# Altium project Kenworth_Overview_2.PrjPcb (part 1 of 4)
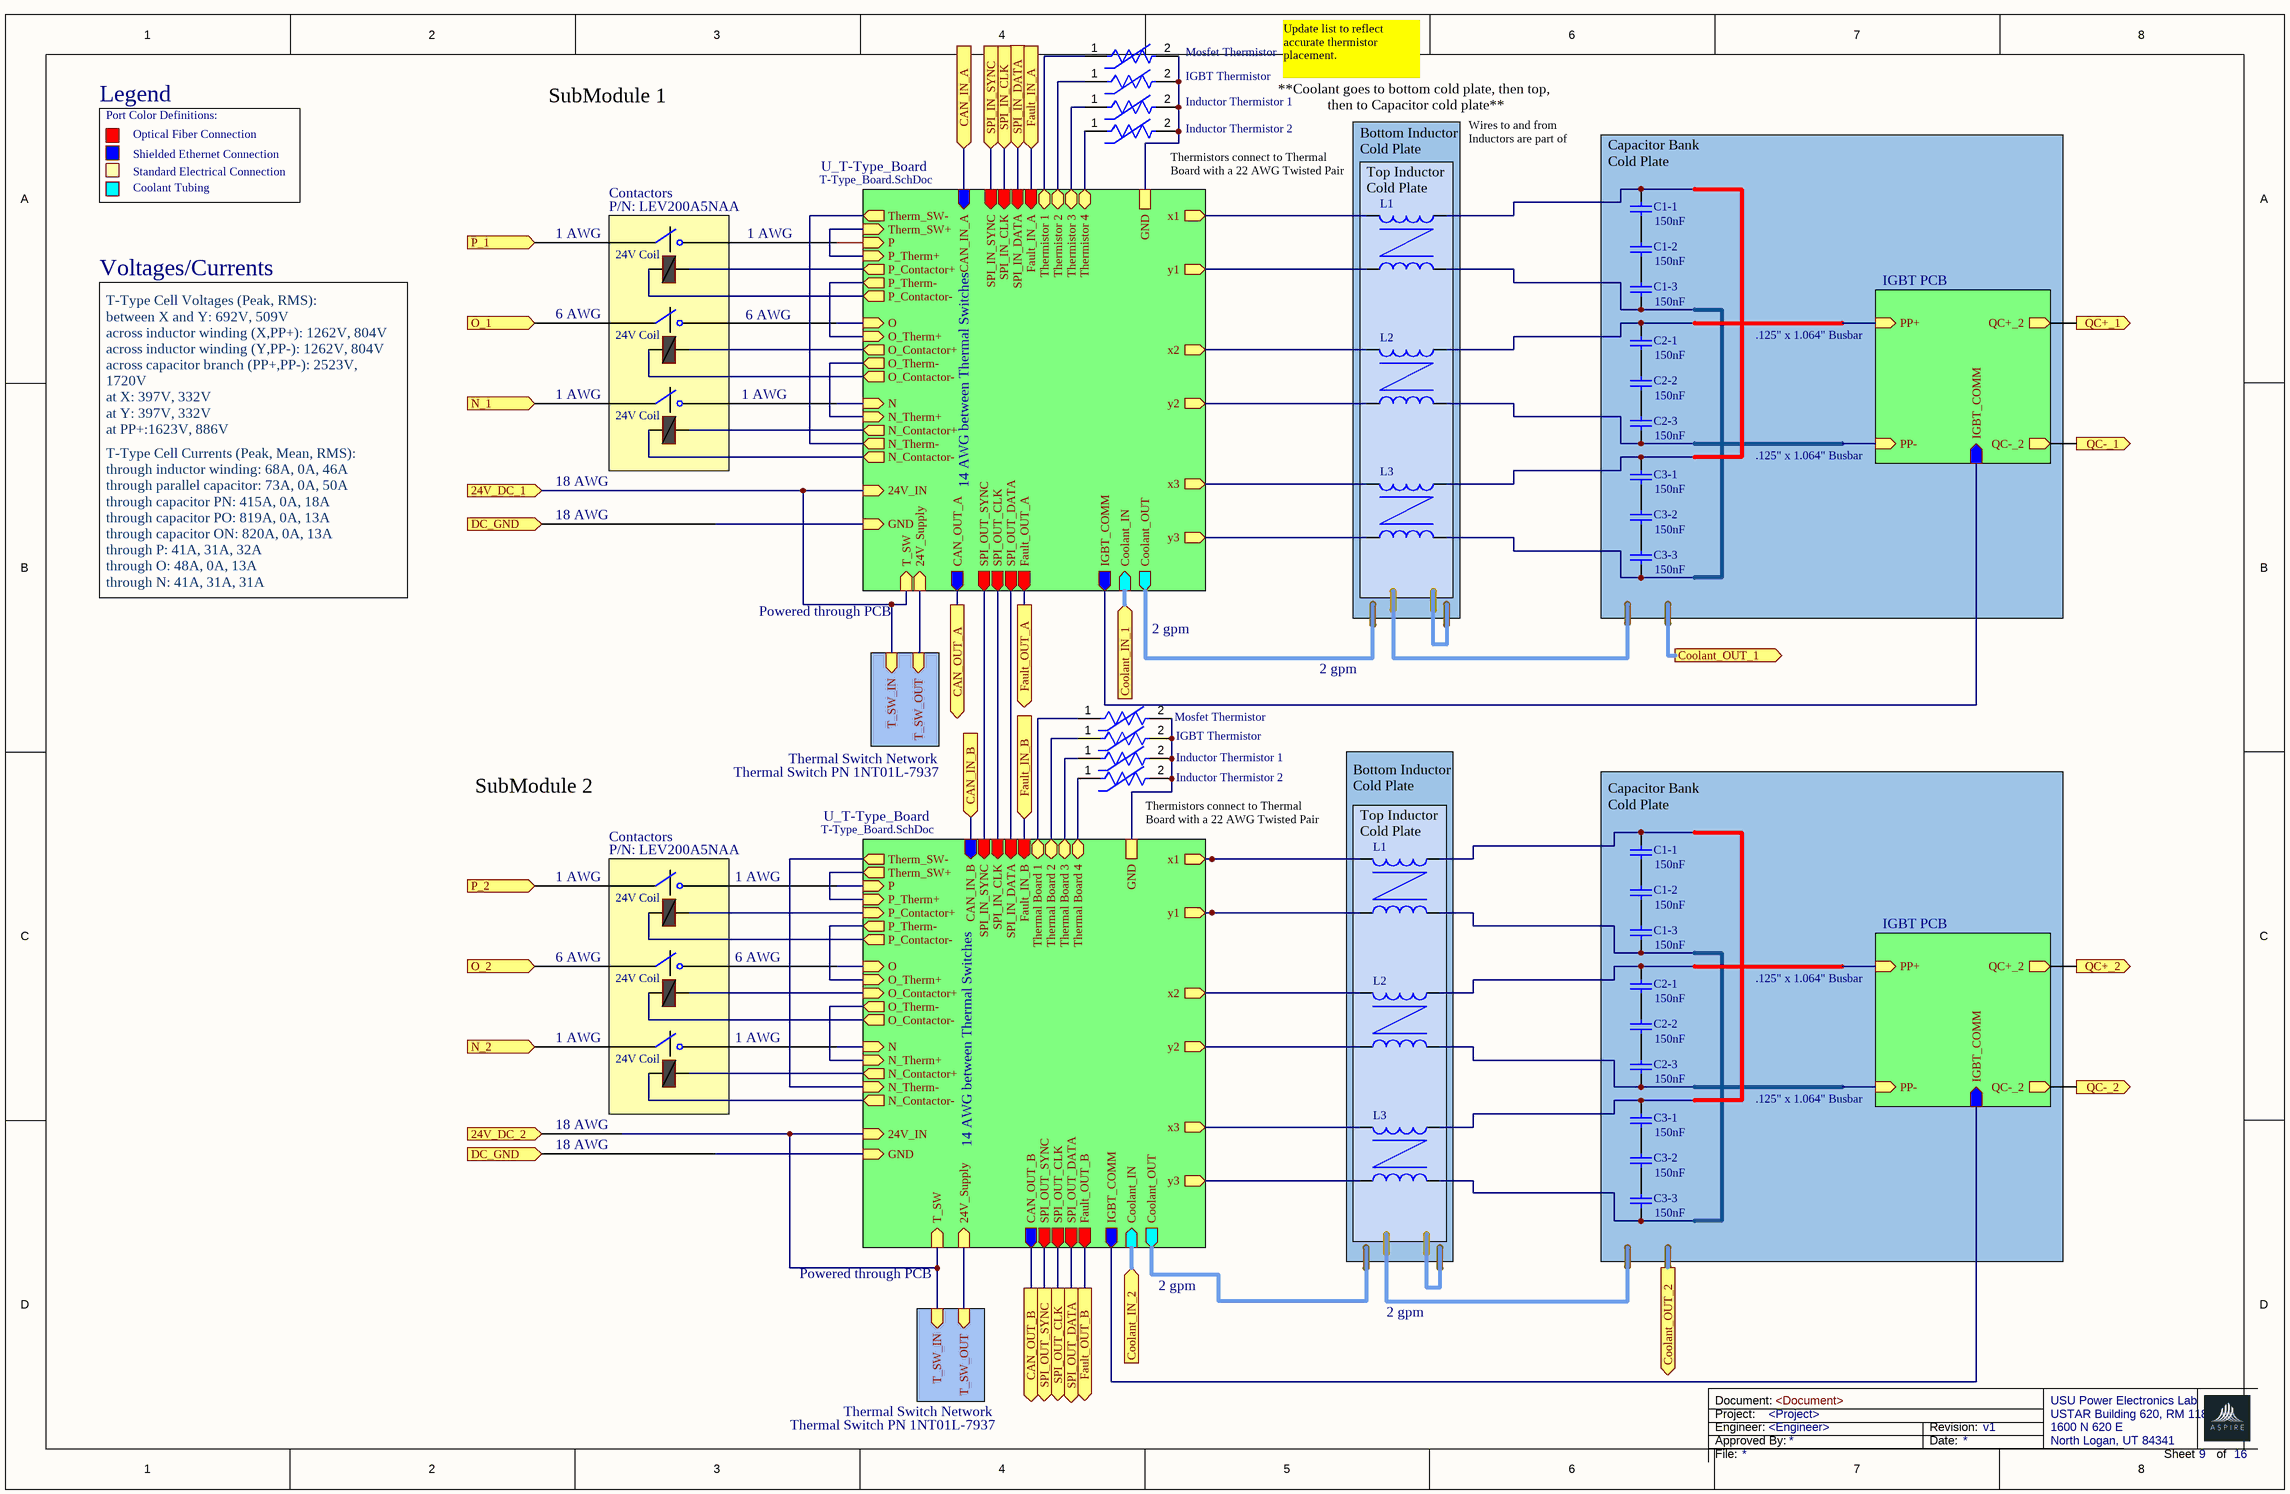
[diagram p0: Full_Module.SchDoc]
19 sheets, 617 parts. Net scope: hierarchical (ports join the sheet entries above them; power ports are global).
Sheets:
  Full_Module.SchDoc
    U_T-Type_Board = T-Type_Board.SchDoc
    U_T-Type_Board = T-Type_Board.SchDoc
    IGBT PCB = T-Type_Board.SchDoc
    IGBT PCB = T-Type_Board.SchDoc
  Primary_Cabinet.SchDoc
    Fuse Block = Fuse_Block.SchDoc
    Unfolder = Unfolder.SchDoc
    T-Type System = T-Type_System.SchDoc
  Coolant_System.SchDoc
  Current_and_Water_Sensing_System.SchDoc
  Top_Overview.SchDoc
    Special Equipment Cabinet = Special_Equipment_Cabinet_Overview.SchDoc
      Shunt Filter = Shunt_Filter.SchDoc
        U_RLC = RLC.SchDoc
        U_RLC = RLC.SchDoc
        U_RLC = RLC.SchDoc
      Auxiliary Circuit = Auxiliary_Circuit.SchDoc
      Relay Circuit = Relay_Circuit.SchDoc
    Secondary Pad = Vehicle_Charger_Hierarchal.SchDoc
      Filter = Filter.SchDoc
      U_Rectifier = Rectifier.SchDoc
    Primary Pad = Underground_Assembly.SchDoc
  Secondary_Pad_Auxiliary_Wiring_Overview.SchDoc

## Sheet Full_Module.SchDoc: <Document>
size Tabloid; Engineer: <Engineer>; Organization: UPEL; Address1: USU Power Electronics Lab; Address2: USTAR Building 620, RM 118; Address3: 1600 N 620 E; Address4: North Logan, UT 84341; DocumentNumber: 9; Revision: v1; SheetNumber: 9; SheetTotal: 16; ProjectName: <Project>

### Parts
(Parts that share a designator on the sheet are numbered #1, #2 ... from top to bottom, then left to right.)
C1-1#1  value 150nF  [RAD-0.3]  (hidden comment: Cap)
C1-1#2  value 150nF  [RAD-0.3]  (hidden comment: Cap)
C1-2#1  value 150nF  [RAD-0.3]  (hidden comment: Cap)
C1-2#2  value 150nF  [RAD-0.3]  (hidden comment: Cap)
C1-3#1  value 150nF  [RAD-0.3]  (hidden comment: Cap)
C1-3#2  value 150nF  [RAD-0.3]  (hidden comment: Cap)
C2-1#1  value 150nF  [RAD-0.3]  (hidden comment: Cap)
C2-1#2  value 150nF  [RAD-0.3]  (hidden comment: Cap)
C2-2#1  value 150nF  [RAD-0.3]  (hidden comment: Cap)
C2-2#2  value 150nF  [RAD-0.3]  (hidden comment: Cap)
C2-3#1  value 150nF  [RAD-0.3]  (hidden comment: Cap)
C2-3#2  value 150nF  [RAD-0.3]  (hidden comment: Cap)
C3-1#1  value 150nF  [RAD-0.3]  (hidden comment: Cap)
C3-1#2  value 150nF  [RAD-0.3]  (hidden comment: Cap)
C3-2#1  value 150nF  [RAD-0.3]  (hidden comment: Cap)
C3-2#2  value 150nF  [RAD-0.3]  (hidden comment: Cap)
C3-3#1  value 150nF  [RAD-0.3]  (hidden comment: Cap)
C3-3#2  value 150nF  [RAD-0.3]  (hidden comment: Cap)
IGBT_Thermistor#1  NTCALUG01A103J  [FP-NTCALUG01A103J-MFG]  (value not drawn)
IGBT_Thermistor#2  NTCALUG01A103J  [FP-NTCALUG01A103J-MFG]  (value not drawn)
Inductor_Thermistor_1#1  NTCALUG01A103J  [FP-NTCALUG01A103J-MFG]  (value not drawn)
Inductor_Thermistor_1#2  NTCALUG01A103J  [FP-NTCALUG01A103J-MFG]  (value not drawn)
Inductor_Thermistor_2#1  NTCALUG01A103J  [FP-NTCALUG01A103J-MFG]  (value not drawn)
Inductor_Thermistor_2#2  NTCALUG01A103J  [FP-NTCALUG01A103J-MFG]  (value not drawn)
K?#1  Contactor  (value not drawn)
K?#2  Contactor  (value not drawn)
K?#3  Contactor  (value not drawn)
K?#4  Contactor  (value not drawn)
K?#5  Contactor  (value not drawn)
K?#6  Contactor  (value not drawn)
L1#1  Inductor  [0402-A]  (value not drawn)
L1#2  Inductor  [0402-A]  (value not drawn)
L2#1  Inductor  [0402-A]  (value not drawn)
L2#2  Inductor  [0402-A]  (value not drawn)
L3#1  Inductor  [0402-A]  (value not drawn)
L3#2  Inductor  [0402-A]  (value not drawn)
L?#1  Inductor  [0402-A]  (value not drawn)
L?#2  Inductor  [0402-A]  (value not drawn)
L?#3  Inductor  [0402-A]  (value not drawn)
L?#4  Inductor  [0402-A]  (value not drawn)
L?#5  Inductor  [0402-A]  (value not drawn)
L?#6  Inductor  [0402-A]  (value not drawn)
Mosfet_Thermistor#1  NTCALUG01A103J  [FP-NTCALUG01A103J-MFG]  (value not drawn)
Mosfet_Thermistor#2  NTCALUG01A103J  [FP-NTCALUG01A103J-MFG]  (value not drawn)

### Sub-sheets
IGBT PCB = T-Type_Board.SchDoc: QC+_2 (out), QC-_2 (out), PP+ (in), PP- (in), IGBT_COMM (in)
IGBT PCB = T-Type_Board.SchDoc: QC+_2 (out), QC-_2 (out), PP+ (in), PP- (in), IGBT_COMM (in)
Thermal Switch Network = File Name (file not in this document): T_SW_OUT (in), T_SW_IN (in)
Thermal Switch Network = File Name (file not in this document): T_SW_OUT (in), T_SW_IN (in)
U_T-Type_Board = T-Type_Board.SchDoc: P (in), O (in), N (in), CAN_IN_A (in), GND (in), 24V_IN (in), Coolant_IN (in), Coolant_OUT (out), x1 (out), y1 (out), SPI_IN_SYNC (in), CAN_OUT_A (out), SPI_OUT_SYNC (out), Fault_OUT_A (out), SPI_OUT_CLK (out), SPI_OUT_DATA (out), SPI_IN_CLK (in), SPI_IN_DATA (in), Fault_IN_A (in), P_Contactor+ (out), P_Contactor- (out), O_Contactor+ (out), N_Contactor+ (out), O_Contactor- (out), N_Contactor- (out), x2 (out), y2 (out), x3 (out), y3 (out), T_SW (in), 24V_Supply (in), IGBT_COMM (out), P_Therm+ (in), P_Therm- (out), N_Therm- (out), N_Therm+ (in), O_Therm- (out), O_Therm+ (in), Therm_SW+ (in), Therm_SW- (out), Thermistor 4 (bidir), Thermistor 3 (bidir), Thermistor 2 (bidir), Thermistor 1 (bidir), GND
U_T-Type_Board = T-Type_Board.SchDoc: P (in), O (in), N (in), GND (in), 24V_IN (in), Coolant_IN (in), Coolant_OUT (out), SPI_IN_SYNC (in), SPI_OUT_SYNC (out), Fault_OUT_B (out), CAN_OUT_B (out), SPI_OUT_CLK (out), SPI_OUT_DATA (out), CAN_IN_B (in), SPI_IN_CLK (in), SPI_IN_DATA (in), Fault_IN_B (in), P_Contactor+ (in), P_Contactor- (out), O_Contactor+ (in), N_Contactor+ (out), O_Contactor- (out), N_Contactor- (out), x1 (out), y1 (out), x2 (out), y2 (out), x3 (out), y3 (out), T_SW (in), 24V_Supply (in), IGBT_COMM (out), N_Therm+ (in), N_Therm- (in), O_Therm+ (in), O_Therm- (out), P_Therm+ (in), P_Therm- (out), Therm_SW+ (out), Therm_SW- (out), Thermal Board 4 (bidir), Thermal Board 3 (bidir), Thermal Board 2 (bidir), Thermal Board 1 (bidir), GND

### Ports
24V_DC_1 (in), 24V_DC_2 (in), CAN_IN_A (in), CAN_IN_B (in), CAN_OUT_A (out), CAN_OUT_B (out), Coolant_IN_1 (in), Coolant_IN_2 (in), Coolant_OUT_1 (out), Coolant_OUT_2 (out), DC_GND (in), Fault_IN_A (in), Fault_IN_B (in), Fault_OUT_A (out), Fault_OUT_B (out), N_1 (in), N_2 (in), O_1 (in), O_2 (in), P_1 (in), P_2 (in), QC+_1 (out), QC+_2 (out), QC-_1 (out), QC-_2 (out), SPI_IN_CLK (in), SPI_IN_DATA (in), SPI_IN_SYNC (in), SPI_OUT_CLK (out), SPI_OUT_DATA (out), SPI_OUT_SYNC (out)

### Nets
24V_DC_1: port 24V_DC_1, sheet U_T-Type_Board/24V_IN, sheet U_T-Type_Board/T_SW, sheet Thermal Switch Network/T_SW_IN
24V_DC_2: port 24V_DC_2, sheet U_T-Type_Board/24V_IN, sheet U_T-Type_Board/T_SW, sheet Thermal Switch Network/T_SW_IN
CAN_IN_A: port CAN_IN_A, sheet U_T-Type_Board/CAN_IN_A
CAN_IN_B: port CAN_IN_B, sheet U_T-Type_Board/CAN_IN_B
CAN_OUT_A: port CAN_OUT_A, sheet U_T-Type_Board/CAN_OUT_A
CAN_OUT_B: port CAN_OUT_B, sheet U_T-Type_Board/CAN_OUT_B
Coolant_IN_U_T-Type_Board: port Coolant_IN_1, sheet U_T-Type_Board/Coolant_IN
Coolant_IN_U_T-Type_Board: port Coolant_IN_2, sheet U_T-Type_Board/Coolant_IN  [a separate net that carries the same name]
DC_GND: IGBT_Thermistor#1.2 IGBT_Thermistor#2.2 Inductor_Thermistor_1#1.2 Inductor_Thermistor_1#2.2 Inductor_Thermistor_2#1.2 Inductor_Thermistor_2#2.2 Mosfet_Thermistor#1.2 Mosfet_Thermistor#2.2 ; port DC_GND, sheet U_T-Type_Board/GND, sheet U_T-Type_Board/GND, sheet U_T-Type_Board/GND, sheet U_T-Type_Board/GND
Fault_IN_A: port Fault_IN_A, sheet U_T-Type_Board/Fault_IN_A
Fault_IN_B: port Fault_IN_B, sheet U_T-Type_Board/Fault_IN_B
Fault_OUT_A: port Fault_OUT_A, sheet U_T-Type_Board/Fault_OUT_A
Fault_OUT_B: port Fault_OUT_B, sheet U_T-Type_Board/Fault_OUT_B
N: K?#3.4 ; sheet U_T-Type_Board/N
N: K?#6.4 ; sheet U_T-Type_Board/N  [a separate net that carries the same name]
N_1: K?#3.3 ; port N_1
N_2: K?#6.3 ; port N_2
N_Contactor+: K?#3.5 ; sheet U_T-Type_Board/N_Contactor+
N_Contactor+: K?#6.5 ; sheet U_T-Type_Board/N_Contactor+  [a separate net that carries the same name]
N_Contactor-: K?#3.6 ; sheet U_T-Type_Board/N_Contactor-
N_Contactor-: K?#6.6 ; sheet U_T-Type_Board/N_Contactor-  [a separate net that carries the same name]
O: K?#2.4 ; sheet U_T-Type_Board/O
O: K?#5.4 ; sheet U_T-Type_Board/O  [a separate net that carries the same name]
O_1: K?#2.3 ; port O_1
O_2: K?#5.3 ; port O_2
O_Contactor+: K?#2.5 ; sheet U_T-Type_Board/O_Contactor+
O_Contactor+: K?#5.5 ; sheet U_T-Type_Board/O_Contactor+  [a separate net that carries the same name]
O_Contactor-: K?#2.6 ; sheet U_T-Type_Board/O_Contactor-
O_Contactor-: K?#5.6 ; sheet U_T-Type_Board/O_Contactor-  [a separate net that carries the same name]
P: K?#1.4 ; sheet U_T-Type_Board/P
P: K?#4.4 ; sheet U_T-Type_Board/P  [a separate net that carries the same name]
P_1: K?#1.3 ; port P_1
P_2: K?#4.3 ; port P_2
P_Contactor+: K?#1.5 ; sheet U_T-Type_Board/P_Contactor+
P_Contactor+: K?#4.5 ; sheet U_T-Type_Board/P_Contactor+  [a separate net that carries the same name]
P_Contactor-: K?#1.6 ; sheet U_T-Type_Board/P_Contactor-
P_Contactor-: K?#4.6 ; sheet U_T-Type_Board/P_Contactor-  [a separate net that carries the same name]
PP+: C2-1#2.2 L2#2.1 ; sheet IGBT PCB/PP+
PP+: C2-1#1.2 L2#1.1 ; sheet IGBT PCB/PP+  [a separate net that carries the same name]
PP-: C2-3#2.1 L?#5.2 ; sheet IGBT PCB/PP-
PP-: C2-3#1.1 L?#2.2 ; sheet IGBT PCB/PP-  [a separate net that carries the same name]
QC+_1: port QC+_1, sheet IGBT PCB/QC+_2
QC+_2: port QC+_2, sheet IGBT PCB/QC+_2
QC-_1: port QC-_1, sheet IGBT PCB/QC-_2
QC-_2: port QC-_2, sheet IGBT PCB/QC-_2
SPI_IN_CLK: port SPI_IN_CLK, sheet U_T-Type_Board/SPI_IN_CLK
SPI_IN_CLK_U_T-Type_Board: sheet U_T-Type_Board/SPI_OUT_CLK, sheet U_T-Type_Board/SPI_IN_CLK
SPI_IN_DATA: port SPI_IN_DATA, sheet U_T-Type_Board/SPI_IN_DATA
SPI_IN_DATA_U_T-Type_Board: sheet U_T-Type_Board/SPI_OUT_DATA, sheet U_T-Type_Board/SPI_IN_DATA
SPI_IN_SYNC: port SPI_IN_SYNC, sheet U_T-Type_Board/SPI_IN_SYNC
SPI_IN_SYNC_U_T-Type_Board: sheet U_T-Type_Board/SPI_OUT_SYNC, sheet U_T-Type_Board/SPI_IN_SYNC
SPI_OUT_CLK: port SPI_OUT_CLK, sheet U_T-Type_Board/SPI_OUT_CLK
SPI_OUT_DATA: port SPI_OUT_DATA, sheet U_T-Type_Board/SPI_OUT_DATA
SPI_OUT_SYNC: port SPI_OUT_SYNC, sheet U_T-Type_Board/SPI_OUT_SYNC
NetC1-1#1_1: C1-1#1.1 C1-2#1.2
NetC1-1#1_2: C1-1#1.2 C3-1#1.2 L1#1.1 L3#1.1
NetC1-1#2_1: C1-1#2.1 C1-2#2.2
NetC1-1#2_2: C1-1#2.2 C3-1#2.2 L1#2.1 L3#2.1
NetC1-2#1_1: C1-2#1.1 C1-3#1.2
NetC1-2#2_1: C1-2#2.1 C1-3#2.2
NetC1-3#1_1: C1-3#1.1 C3-3#1.1 L?#1.2 L?#3.2
NetC1-3#2_1: C1-3#2.1 C3-3#2.1 L?#4.2 L?#6.2
NetC2-1#1_1: C2-1#1.1 C2-2#1.2
NetC2-1#2_1: C2-1#2.1 C2-2#2.2
NetC2-2#1_1: C2-2#1.1 C2-3#1.2
NetC2-2#2_1: C2-2#2.1 C2-3#2.2
NetC3-1#1_1: C3-1#1.1 C3-2#1.2
NetC3-1#2_1: C3-1#2.1 C3-2#2.2
NetC3-2#1_1: C3-2#1.1 C3-3#1.2
NetC3-2#2_1: C3-2#2.1 C3-3#2.2
NetIGBT_Thermistor#1_1: IGBT_Thermistor#1.1 ; sheet U_T-Type_Board/Thermistor 2
NetIGBT_Thermistor#2_1: IGBT_Thermistor#2.1 ; sheet U_T-Type_Board/Thermal Board 2
NetInductor_Thermistor_1#1_1: Inductor_Thermistor_1#1.1 ; sheet U_T-Type_Board/Thermistor 3
NetInductor_Thermistor_1#2_1: Inductor_Thermistor_1#2.1 ; sheet U_T-Type_Board/Thermal Board 3
NetInductor_Thermistor_2#1_1: Inductor_Thermistor_2#1.1 ; sheet U_T-Type_Board/Thermistor 4
NetInductor_Thermistor_2#2_1: Inductor_Thermistor_2#2.1 ; sheet U_T-Type_Board/Thermal Board 4
NetL1#1_2: L1#1.2 ; sheet U_T-Type_Board/x1
NetL1#2_2: L1#2.2 ; sheet U_T-Type_Board/x1
NetL2#1_2: L2#1.2 ; sheet U_T-Type_Board/x2
NetL2#2_2: L2#2.2 ; sheet U_T-Type_Board/x2
NetL3#1_2: L3#1.2 ; sheet U_T-Type_Board/x3
NetL3#2_2: L3#2.2 ; sheet U_T-Type_Board/x3
NetL?#1_1: L?#1.1 ; sheet U_T-Type_Board/y1
NetL?#2_1: L?#2.1 ; sheet U_T-Type_Board/y2
NetL?#3_1: L?#3.1 ; sheet U_T-Type_Board/y3
NetL?#4_1: L?#4.1 ; sheet U_T-Type_Board/y1
NetL?#5_1: L?#5.1 ; sheet U_T-Type_Board/y2
NetL?#6_1: L?#6.1 ; sheet U_T-Type_Board/y3
NetMosfet_Thermistor#1_1: Mosfet_Thermistor#1.1 ; sheet U_T-Type_Board/Thermistor 1
NetMosfet_Thermistor#2_1: Mosfet_Thermistor#2.1 ; sheet U_T-Type_Board/Thermal Board 1
(unnamed): sheet U_T-Type_Board/24V_Supply, sheet Thermal Switch Network/T_SW_OUT
(unnamed): sheet U_T-Type_Board/IGBT_COMM, sheet IGBT PCB/IGBT_COMM
(unnamed): sheet U_T-Type_Board/P_Therm+, sheet U_T-Type_Board/Therm_SW+
(unnamed): sheet U_T-Type_Board/P_Therm-, sheet U_T-Type_Board/O_Therm+
(unnamed): sheet U_T-Type_Board/N_Therm-, sheet U_T-Type_Board/Therm_SW-
(unnamed): sheet U_T-Type_Board/N_Therm+, sheet U_T-Type_Board/O_Therm-
(unnamed): sheet U_T-Type_Board/24V_Supply, sheet Thermal Switch Network/T_SW_OUT
(unnamed): sheet U_T-Type_Board/IGBT_COMM, sheet IGBT PCB/IGBT_COMM
(unnamed): sheet U_T-Type_Board/N_Therm+, sheet U_T-Type_Board/O_Therm-
(unnamed): sheet U_T-Type_Board/N_Therm-, sheet U_T-Type_Board/Therm_SW-
(unnamed): sheet U_T-Type_Board/O_Therm+, sheet U_T-Type_Board/P_Therm-
(unnamed): sheet U_T-Type_Board/P_Therm+, sheet U_T-Type_Board/Therm_SW+

### Notes on the sheet
- Legend
- SubModule 1
- Update list to reflect accurate thermistor placement.
- Port Color Definitions:
- Optical Fiber Connection
- Shielded Ethernet Connection
- Standard Electrical Connection
- **Coolant goes to bottom cold plate, then top,
  then to Capacitor cold plate**
- Bottom Inductor Cold Plate
- Wires to and from Inductors are part of custom made inductors
- (near C1-1#1) Capacitor Bank Cold Plate
- Coolant Tubing
- 1 AWG
- (near K?#1) Contactors
- (near K?#1) P/N: LEV200A5NAA
- (near Inductor_Thermistor_2#1) Thermistors connect to Thermal Board with a 22 AWG Twisted Pair with GND
- (near L1#1) Top Inductor Cold Plate
- Voltages/Currents
- (near K?#1) 24V Coil
- 6 AWG
- (near K?#2) 24V Coil
- .125" x 1.064" Busbar
- T-Type Cell Voltages (Peak, RMS):
  between X and Y: 692V, 509V
  across inductor winding (X,PP+): 1262V, 804V
  across inductor winding (Y,PP-): 1262V, 804V
  across capacitor branch (PP+,PP-): 2523V, 1720V
  at X: 397V, 332V
  at Y: 397V, 332V
  at PP+:1623V, 886V
  at PP-: 1623V, 886V
- (near K?#3) 24V Coil
- 18 AWG
- 14 AWG between Thermal Switches
- T-Type Cell Currents (Peak, Mean, RMS):
  through inductor winding: 68A, 0A, 46A
  through parallel capacitor: 73A, 0A, 50A
  through capacitor PN: 415A, 0A, 18A
  through capacitor PO: 819A, 0A, 13A
  through capacitor ON: 820A, 0A, 13A
  through P: 41A, 31A, 32A
  through O: 48A, 0A, 13A
  through N: 41A, 31A, 31A
- Powered through PCB
- 2 gpm
- Thermal Switch PN 1NT01L-7937
- Thermal Switch Network
- SubModule 2
- (near K?#4) Contactors
- (near Inductor_Thermistor_2#2) Thermistors connect to Thermal Board with a 22 AWG Twisted Pair with GND
- (near L1#2) Top Inductor Cold Plate
- (near C1-1#2) Capacitor Bank Cold Plate
- (near K?#4) P/N: LEV200A5NAA
- (near K?#4) 24V Coil
- (near K?#4) 1 AWG
- (near K?#5) 24V Coil
- (near K?#5) 6 AWG
- (near K?#6) 1 AWG
- (near K?#6) 24V Coil
- Project:
- Engineer:
- Document:
- Approved By:
- Date:
- Revision:
- File:
- Sheet
- of

### Library data of the parts
C1-1#1 C1-1#2 C1-2#1 C1-2#2 C1-3#1 C1-3#2 C2-1#1 C2-1#2 C2-2#1 C2-2#2 C2-3#1 C2-3#2 C3-1#1 C3-1#2 C3-2#1 C3-2#2 C3-3#1 C3-3#2 = Cap: Capacitor; Published: 8-Jun-2000; LatestRevisionDate: 17-Jul-2002; LatestRevisionNote: Re-released for DXP Platform.; PackageReference: RAD-0.3; Publisher: Altium Limited; PackageDescription: Radial Cap, Thru-Hole; 2 Leads; 0.3 in Pin Spacing
IGBT_Thermistor#1 IGBT_Thermistor#2 Inductor_Thermistor_1#1 Inductor_Thermistor_1#2 Inductor_Thermistor_2#1 Inductor_Thermistor_2#2 Mosfet_Thermistor#1 Mosfet_Thermistor#2 = CMP-009-00000-2: NTC Thermistor, 10000ohm, Chassis Mount
L1#1 L1#2 L2#1 L2#2 L3#1 L3#2 L?#1-L?#6 = Inductor: Code_IEC: 1005; Value: 10mH; Published: 8-Jun-2000; LatestRevisionDate: 29-May-2009; LatestRevisionNote: IPC-7351 Footprint Added.; PackageReference: 0402-A; Publisher: Altium Limited; PackageDescription: Chip Inductor; Code_JEITA: 0402

## Sheet T-Type_Board.SchDoc: <Document>
size Letter; Engineer: <Engineer>; Organization: UPEL; Address1: USU Power Electronics Lab; Address2: USTAR Building 620, RM 118; Address3: 1600 N 620 E; Address4: North Logan, UT 84341; DocumentNumber: 10; Revision: v1; SheetNumber: 10; SheetTotal: 16; ProjectName: <Project>
Used 4 times, as channels U_T-Type_Board, U_T-Type_Board, IGBT PCB, IGBT PCB. Parts and nets are listed once, with the designators drawn on the sheet.
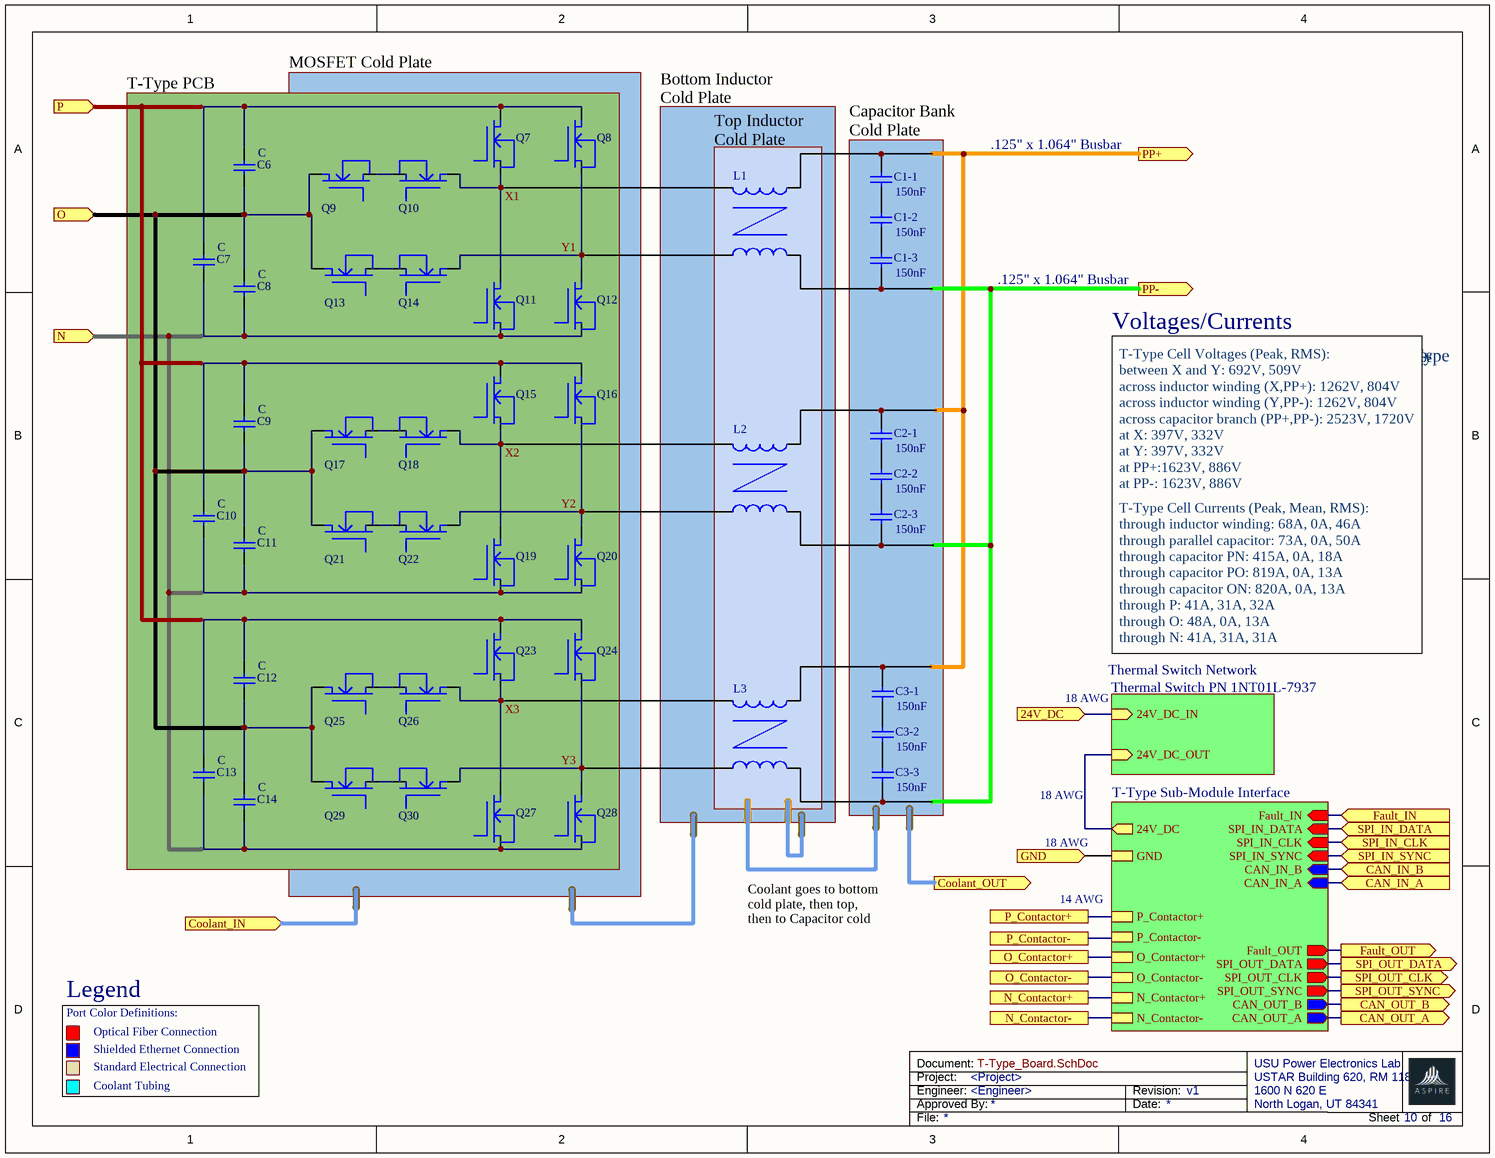
[diagram p1: T-Type_Board.SchDoc]

### Parts
(Parts that share a designator on the sheet are numbered #1, #2 ... from top to bottom, then left to right.)
C1-1  value 150nF  [RAD-0.3]  (hidden comment: Cap)
C1-2  value 150nF  [RAD-0.3]  (hidden comment: Cap)
C1-3  value 150nF  [RAD-0.3]  (hidden comment: Cap)
C2-1  value 150nF  [RAD-0.3]  (hidden comment: Cap)
C2-2  value 150nF  [RAD-0.3]  (hidden comment: Cap)
C2-3  value 150nF  [RAD-0.3]  (hidden comment: Cap)
C3-1  value 150nF  [RAD-0.3]  (hidden comment: Cap)
C3-2  value 150nF  [RAD-0.3]  (hidden comment: Cap)
C3-3  value 150nF  [RAD-0.3]  (hidden comment: Cap)
C6  C  [RAD-0.3]
C7  C  [RAD-0.3]
C8  C  [RAD-0.3]
C9  C  [RAD-0.3]
C10  C  [RAD-0.3]
C11  C  [RAD-0.3]
C12  C  [RAD-0.3]
C13  C  [RAD-0.3]
C14  C  [RAD-0.3]
L1  Inductor  [0402-A]  (value not drawn)
L2  Inductor  [0402-A]  (value not drawn)
L3  Inductor  [0402-A]  (value not drawn)
L?#1  Inductor  [0402-A]  (value not drawn)
L?#2  Inductor  [0402-A]  (value not drawn)
L?#3  Inductor  [0402-A]  (value not drawn)
Q7  T-Cell_component  (value not drawn)
Q8  T-Cell_component  (value not drawn)
Q9  T-Cell_component  (value not drawn)
Q10  T-Cell_component  (value not drawn)
Q11  T-Cell_component  (value not drawn)
Q12  T-Cell_component  (value not drawn)
Q13  T-Cell_component  (value not drawn)
Q14  T-Cell_component  (value not drawn)
Q15  T-Cell_component  (value not drawn)
Q16  T-Cell_component  (value not drawn)
Q17  T-Cell_component  (value not drawn)
Q18  T-Cell_component  (value not drawn)
Q19  T-Cell_component  (value not drawn)
Q20  T-Cell_component  (value not drawn)
Q21  T-Cell_component  (value not drawn)
Q22  T-Cell_component  (value not drawn)
Q23  T-Cell_component  (value not drawn)
Q24  T-Cell_component  (value not drawn)
Q25  T-Cell_component  (value not drawn)
Q26  T-Cell_component  (value not drawn)
Q27  T-Cell_component  (value not drawn)
Q28  T-Cell_component  (value not drawn)
Q29  T-Cell_component  (value not drawn)
Q30  T-Cell_component  (value not drawn)

### Blocks framed on the sheet
MOSFET Cold Plate: Q7-Q30

### Sub-sheets
T-Type Sub-Module Interface = File Name (file not in this document): 24V_DC (out), GND, CAN_IN_A (in), SPI_IN_SYNC (in), CAN_IN_B (in), SPI_IN_CLK (in), SPI_IN_DATA (in), Fault_IN (in), CAN_OUT_A (out), SPI_OUT_SYNC (out), Fault_OUT (out), CAN_OUT_B (out), SPI_OUT_CLK (out), SPI_OUT_DATA (out), P_Contactor+, P_Contactor-, O_Contactor+, O_Contactor-, N_Contactor+, N_Contactor-
Thermal Switch Network = File Name (file not in this document): 24V_DC_IN (in), 24V_DC_OUT (in)

### Ports
24V_DC (in), CAN_IN_A (in), CAN_IN_B (in), CAN_OUT_A (out), CAN_OUT_B (out), Coolant_IN (in), Coolant_OUT (out), Fault_IN (in), Fault_OUT (out), GND (in), N (in), N_Contactor+, N_Contactor-, O (in), O_Contactor+, O_Contactor-, P (in), P_Contactor+, P_Contactor-, PP+ (out), PP- (out), SPI_IN_CLK (in), SPI_IN_DATA (in), SPI_IN_SYNC (in), SPI_OUT_CLK (out), SPI_OUT_DATA (out), SPI_OUT_SYNC (out)

### Nets
24V_DC: port 24V_DC, sheet Thermal Switch Network/24V_DC_IN
CAN_IN_A: port CAN_IN_A, sheet T-Type Sub-Module Interface/CAN_IN_A
CAN_IN_B: port CAN_IN_B, sheet T-Type Sub-Module Interface/CAN_IN_B
CAN_OUT_A: port CAN_OUT_A, sheet T-Type Sub-Module Interface/CAN_OUT_A
CAN_OUT_B: port CAN_OUT_B, sheet T-Type Sub-Module Interface/CAN_OUT_B
Fault_IN: port Fault_IN, sheet T-Type Sub-Module Interface/Fault_IN
Fault_OUT: port Fault_OUT, sheet T-Type Sub-Module Interface/Fault_OUT
GND: port GND, sheet T-Type Sub-Module Interface/GND
N_Contactor+: port N_Contactor+, sheet T-Type Sub-Module Interface/N_Contactor+
N_Contactor-: port N_Contactor-, sheet T-Type Sub-Module Interface/N_Contactor-
O: C9.1 C11.2 Q17.4 Q21.4 ; port O
O_Contactor+: port O_Contactor+, sheet T-Type Sub-Module Interface/O_Contactor+
O_Contactor-: port O_Contactor-, sheet T-Type Sub-Module Interface/O_Contactor-
P_Contactor+: port P_Contactor+, sheet T-Type Sub-Module Interface/P_Contactor+
PP+: C1-1.2 C2-1.2 C3-1.2 L1.1 L2.1 L3.1 ; port PP+
PP-: C1-3.1 C2-3.1 C3-3.1 L?#1.2 L?#2.2 L?#3.2 ; port PP-
SPI_IN_CLK: port SPI_IN_CLK, sheet T-Type Sub-Module Interface/SPI_IN_CLK
SPI_IN_DATA: port SPI_IN_DATA, sheet T-Type Sub-Module Interface/SPI_IN_DATA
SPI_IN_SYNC: port SPI_IN_SYNC, sheet T-Type Sub-Module Interface/SPI_IN_SYNC
SPI_OUT_CLK: port SPI_OUT_CLK, sheet T-Type Sub-Module Interface/SPI_OUT_CLK
SPI_OUT_DATA: port SPI_OUT_DATA, sheet T-Type Sub-Module Interface/SPI_OUT_DATA
SPI_OUT_SYNC: port SPI_OUT_SYNC, sheet T-Type Sub-Module Interface/SPI_OUT_SYNC
X1: L1.2 Q7.5 Q10.4 Q11.4
X2: L2.2 Q15.5 Q18.4 Q19.4
X3: L3.2 Q23.5 Q26.4 Q27.4
Y1: L?#1.1 Q8.5 Q12.4 Q14.4
Y2: L?#2.1 Q16.5 Q20.4 Q22.4
Y3: L?#3.1 Q24.5 Q28.4 Q30.4
NetC1-1_1: C1-1.1 C1-2.2
NetC1-2_1: C1-2.1 C1-3.2
NetC2-1_1: C2-1.1 C2-2.2
NetC2-2_1: C2-2.1 C2-3.2
NetC3-1_1: C3-1.1 C3-2.2
NetC3-2_1: C3-2.1 C3-3.2
NetC6_1: C6.1 C8.2 Q9.4 Q13.4
NetC6_2: C6.2 C7.2 Q7.4 Q8.4
NetC7_1: C7.1 C8.1 Q11.5 Q12.5
NetC9_2: C9.2 C10.2 Q15.4 Q16.4
NetC10_1: C10.1 C11.1 Q19.5 Q20.5
NetC12_1: C12.1 C14.2 Q25.4 Q29.4
NetC12_2: C12.2 C13.2 Q23.4 Q24.4
NetC13_1: C13.1 C14.1 Q27.5 Q28.5
NetQ9_5: Q9.5 Q10.5
NetQ13_5: Q13.5 Q14.5
NetQ17_5: Q17.5 Q18.5
NetQ21_5: Q21.5 Q22.5
NetQ25_5: Q25.5 Q26.5
NetQ29_5: Q29.5 Q30.5
(unnamed): sheet T-Type Sub-Module Interface/24V_DC, sheet Thermal Switch Network/24V_DC_OUT

### Channels
U_T-Type_Board: designators C1-1=C1-1_U_T-Type_Board#1 C1-2=C1-2_U_T-Type_Board#1 C1-3=C1-3_U_T-Type_Board#1 C2-1=C2-1_U_T-Type_Board#1 C2-2=C2-2_U_T-Type_Board#1 C2-3=C2-3_U_T-Type_Board#1 C3-1=C3-1_U_T-Type_Board#1 C3-2=C3-2_U_T-Type_Board#1 C3-3=C3-3_U_T-Type_Board#1 C6=C6_U_T-Type_Board#1 C7=C7_U_T-Type_Board#1 C8=C8_U_T-Type_Board#1 C9=C9_U_T-Type_Board#1 C10=C10_U_T-Type_Board#1 C11=C11_U_T-Type_Board#1 C12=C12_U_T-Type_Board#1 C13=C13_U_T-Type_Board#1 C14=C14_U_T-Type_Board#1 L1=L1_U_T-Type_Board#1 L2=L2_U_T-Type_Board#1 L3=L3_U_T-Type_Board#1 L?=L?_U_T-Type_Board#1 L?=L?_U_T-Type_Board#2 L?=L?_U_T-Type_Board#3 Q7=Q7_U_T-Type_Board#1 Q8=Q8_U_T-Type_Board#1 Q9=Q9_U_T-Type_Board#1 Q10=Q10_U_T-Type_Board#1 Q11=Q11_U_T-Type_Board#1 Q12=Q12_U_T-Type_Board#1 Q13=Q13_U_T-Type_Board#1 Q14=Q14_U_T-Type_Board#1 Q15=Q15_U_T-Type_Board#1 Q16=Q16_U_T-Type_Board#1 Q17=Q17_U_T-Type_Board#1 Q18=Q18_U_T-Type_Board#1 Q19=Q19_U_T-Type_Board#1 Q20=Q20_U_T-Type_Board#1 Q21=Q21_U_T-Type_Board#1 Q22=Q22_U_T-Type_Board#1 Q23=Q23_U_T-Type_Board#1 Q24=Q24_U_T-Type_Board#1 Q25=Q25_U_T-Type_Board#1 Q26=Q26_U_T-Type_Board#1 Q27=Q27_U_T-Type_Board#1 Q28=Q28_U_T-Type_Board#1 Q29=Q29_U_T-Type_Board#1 Q30=Q30_U_T-Type_Board#1; ports 24V_DC=24V_DC_U_T-Type_Board CAN_IN_A=CAN_IN_A CAN_IN_B=CAN_IN_B_U_T-Type_Board CAN_OUT_A=CAN_OUT_A CAN_OUT_B=CAN_OUT_B_U_T-Type_Board Coolant_IN=Coolant_IN_U_T-Type_Board Coolant_OUT=Coolant_OUT_U_T-Type_Board Fault_IN=Fault_IN_U_T-Type_Board Fault_OUT=Fault_OUT_U_T-Type_Board GND=DC_GND N=N N_Contactor+=N_Contactor+ N_Contactor-=N_Contactor- O=O O_Contactor+=O_Contactor+ O_Contactor-=O_Contactor- P=P P_Contactor+=P_Contactor+ P_Contactor-=P_Contactor- PP+=PP+_U_T-Type_Board PP-=PP-_U_T-Type_Board SPI_IN_CLK=SPI_IN_CLK SPI_IN_DATA=SPI_IN_DATA SPI_IN_SYNC=SPI_IN_SYNC SPI_OUT_CLK=SPI_IN_CLK_U_T-Type_Board SPI_OUT_DATA=SPI_IN_DATA_U_T-Type_Board SPI_OUT_SYNC=SPI_IN_SYNC_U_T-Type_Board
U_T-Type_Board: designators C1-1=C1-1_U_T-Type_Board#2 C1-2=C1-2_U_T-Type_Board#2 C1-3=C1-3_U_T-Type_Board#2 C2-1=C2-1_U_T-Type_Board#2 C2-2=C2-2_U_T-Type_Board#2 C2-3=C2-3_U_T-Type_Board#2 C3-1=C3-1_U_T-Type_Board#2 C3-2=C3-2_U_T-Type_Board#2 C3-3=C3-3_U_T-Type_Board#2 C6=C6_U_T-Type_Board#2 C7=C7_U_T-Type_Board#2 C8=C8_U_T-Type_Board#2 C9=C9_U_T-Type_Board#2 C10=C10_U_T-Type_Board#2 C11=C11_U_T-Type_Board#2 C12=C12_U_T-Type_Board#2 C13=C13_U_T-Type_Board#2 C14=C14_U_T-Type_Board#2 L1=L1_U_T-Type_Board#2 L2=L2_U_T-Type_Board#2 L3=L3_U_T-Type_Board#2 L?=L?_U_T-Type_Board#4 L?=L?_U_T-Type_Board#5 L?=L?_U_T-Type_Board#6 Q7=Q7_U_T-Type_Board#2 Q8=Q8_U_T-Type_Board#2 Q9=Q9_U_T-Type_Board#2 Q10=Q10_U_T-Type_Board#2 Q11=Q11_U_T-Type_Board#2 Q12=Q12_U_T-Type_Board#2 Q13=Q13_U_T-Type_Board#2 Q14=Q14_U_T-Type_Board#2 Q15=Q15_U_T-Type_Board#2 Q16=Q16_U_T-Type_Board#2 Q17=Q17_U_T-Type_Board#2 Q18=Q18_U_T-Type_Board#2 Q19=Q19_U_T-Type_Board#2 Q20=Q20_U_T-Type_Board#2 Q21=Q21_U_T-Type_Board#2 Q22=Q22_U_T-Type_Board#2 Q23=Q23_U_T-Type_Board#2 Q24=Q24_U_T-Type_Board#2 Q25=Q25_U_T-Type_Board#2 Q26=Q26_U_T-Type_Board#2 Q27=Q27_U_T-Type_Board#2 Q28=Q28_U_T-Type_Board#2 Q29=Q29_U_T-Type_Board#2 Q30=Q30_U_T-Type_Board#2; ports 24V_DC=24V_DC_U_T-Type_Board CAN_IN_A=CAN_IN_A_U_T-Type_Board CAN_IN_B=CAN_IN_B CAN_OUT_A=CAN_OUT_A_U_T-Type_Board CAN_OUT_B=CAN_OUT_B Coolant_IN=Coolant_IN_U_T-Type_Board Coolant_OUT=Coolant_OUT_U_T-Type_Board Fault_IN=Fault_IN_U_T-Type_Board Fault_OUT=Fault_OUT_U_T-Type_Board GND=DC_GND N=N N_Contactor+=N_Contactor+ N_Contactor-=N_Contactor- O=O O_Contactor+=O_Contactor+ O_Contactor-=O_Contactor- P=P P_Contactor+=P_Contactor+ P_Contactor-=P_Contactor- PP+=PP+_U_T-Type_Board PP-=PP-_U_T-Type_Board SPI_IN_CLK=SPI_IN_CLK_U_T-Type_Board SPI_IN_DATA=SPI_IN_DATA_U_T-Type_Board SPI_IN_SYNC=SPI_IN_SYNC_U_T-Type_Board SPI_OUT_CLK=SPI_OUT_CLK SPI_OUT_DATA=SPI_OUT_DATA SPI_OUT_SYNC=SPI_OUT_SYNC
IGBT PCB: designators C1-1=C1-1_IGBT_PCB#1 C1-2=C1-2_IGBT_PCB#1 C1-3=C1-3_IGBT_PCB#1 C2-1=C2-1_IGBT_PCB#1 C2-2=C2-2_IGBT_PCB#1 C2-3=C2-3_IGBT_PCB#1 C3-1=C3-1_IGBT_PCB#1 C3-2=C3-2_IGBT_PCB#1 C3-3=C3-3_IGBT_PCB#1 C6=C6_IGBT_PCB#1 C7=C7_IGBT_PCB#1 C8=C8_IGBT_PCB#1 C9=C9_IGBT_PCB#1 C10=C10_IGBT_PCB#1 C11=C11_IGBT_PCB#1 C12=C12_IGBT_PCB#1 C13=C13_IGBT_PCB#1 C14=C14_IGBT_PCB#1 L1=L1_IGBT_PCB#1 L2=L2_IGBT_PCB#1 L3=L3_IGBT_PCB#1 L?=L?_IGBT_PCB#1 L?=L?_IGBT_PCB#2 L?=L?_IGBT_PCB#3 Q7=Q7_IGBT_PCB#1 Q8=Q8_IGBT_PCB#1 Q9=Q9_IGBT_PCB#1 Q10=Q10_IGBT_PCB#1 Q11=Q11_IGBT_PCB#1 Q12=Q12_IGBT_PCB#1 Q13=Q13_IGBT_PCB#1 Q14=Q14_IGBT_PCB#1 Q15=Q15_IGBT_PCB#1 Q16=Q16_IGBT_PCB#1 Q17=Q17_IGBT_PCB#1 Q18=Q18_IGBT_PCB#1 Q19=Q19_IGBT_PCB#1 Q20=Q20_IGBT_PCB#1 Q21=Q21_IGBT_PCB#1 Q22=Q22_IGBT_PCB#1 Q23=Q23_IGBT_PCB#1 Q24=Q24_IGBT_PCB#1 Q25=Q25_IGBT_PCB#1 Q26=Q26_IGBT_PCB#1 Q27=Q27_IGBT_PCB#1 Q28=Q28_IGBT_PCB#1 Q29=Q29_IGBT_PCB#1 Q30=Q30_IGBT_PCB#1; ports 24V_DC=24V_DC_IGBT PCB CAN_IN_A=CAN_IN_A_IGBT PCB CAN_IN_B=CAN_IN_B_IGBT PCB CAN_OUT_A=CAN_OUT_A_IGBT PCB CAN_OUT_B=CAN_OUT_B_IGBT PCB Coolant_IN=Coolant_IN_IGBT PCB Coolant_OUT=Coolant_OUT_IGBT PCB Fault_IN=Fault_IN_IGBT PCB Fault_OUT=Fault_OUT_IGBT PCB GND=GND_IGBT PCB N=N_IGBT PCB N_Contactor+=N_Contactor+_IGBT PCB N_Contactor-=N_Contactor-_IGBT PCB O=O_IGBT PCB O_Contactor+=O_Contactor+_IGBT PCB O_Contactor-=O_Contactor-_IGBT PCB P=P_IGBT PCB P_Contactor+=P_Contactor+_IGBT PCB P_Contactor-=P_Contactor-_IGBT PCB PP+=PP+ PP-=PP- SPI_IN_CLK=SPI_IN_CLK_IGBT PCB SPI_IN_DATA=SPI_IN_DATA_IGBT PCB SPI_IN_SYNC=SPI_IN_SYNC_IGBT PCB SPI_OUT_CLK=SPI_OUT_CLK_IGBT PCB SPI_OUT_DATA=SPI_OUT_DATA_IGBT PCB SPI_OUT_SYNC=SPI_OUT_SYNC_IGBT PCB
IGBT PCB: designators C1-1=C1-1_IGBT_PCB#2 C1-2=C1-2_IGBT_PCB#2 C1-3=C1-3_IGBT_PCB#2 C2-1=C2-1_IGBT_PCB#2 C2-2=C2-2_IGBT_PCB#2 C2-3=C2-3_IGBT_PCB#2 C3-1=C3-1_IGBT_PCB#2 C3-2=C3-2_IGBT_PCB#2 C3-3=C3-3_IGBT_PCB#2 C6=C6_IGBT_PCB#2 C7=C7_IGBT_PCB#2 C8=C8_IGBT_PCB#2 C9=C9_IGBT_PCB#2 C10=C10_IGBT_PCB#2 C11=C11_IGBT_PCB#2 C12=C12_IGBT_PCB#2 C13=C13_IGBT_PCB#2 C14=C14_IGBT_PCB#2 L1=L1_IGBT_PCB#2 L2=L2_IGBT_PCB#2 L3=L3_IGBT_PCB#2 L?=L?_IGBT_PCB#4 L?=L?_IGBT_PCB#5 L?=L?_IGBT_PCB#6 Q7=Q7_IGBT_PCB#2 Q8=Q8_IGBT_PCB#2 Q9=Q9_IGBT_PCB#2 Q10=Q10_IGBT_PCB#2 Q11=Q11_IGBT_PCB#2 Q12=Q12_IGBT_PCB#2 Q13=Q13_IGBT_PCB#2 Q14=Q14_IGBT_PCB#2 Q15=Q15_IGBT_PCB#2 Q16=Q16_IGBT_PCB#2 Q17=Q17_IGBT_PCB#2 Q18=Q18_IGBT_PCB#2 Q19=Q19_IGBT_PCB#2 Q20=Q20_IGBT_PCB#2 Q21=Q21_IGBT_PCB#2 Q22=Q22_IGBT_PCB#2 Q23=Q23_IGBT_PCB#2 Q24=Q24_IGBT_PCB#2 Q25=Q25_IGBT_PCB#2 Q26=Q26_IGBT_PCB#2 Q27=Q27_IGBT_PCB#2 Q28=Q28_IGBT_PCB#2 Q29=Q29_IGBT_PCB#2 Q30=Q30_IGBT_PCB#2; ports 24V_DC=24V_DC_IGBT PCB CAN_IN_A=CAN_IN_A_IGBT PCB CAN_IN_B=CAN_IN_B_IGBT PCB CAN_OUT_A=CAN_OUT_A_IGBT PCB CAN_OUT_B=CAN_OUT_B_IGBT PCB Coolant_IN=Coolant_IN_IGBT PCB Coolant_OUT=Coolant_OUT_IGBT PCB Fault_IN=Fault_IN_IGBT PCB Fault_OUT=Fault_OUT_IGBT PCB GND=GND_IGBT PCB N=N_IGBT PCB N_Contactor+=N_Contactor+_IGBT PCB N_Contactor-=N_Contactor-_IGBT PCB O=O_IGBT PCB O_Contactor+=O_Contactor+_IGBT PCB O_Contactor-=O_Contactor-_IGBT PCB P=P_IGBT PCB P_Contactor+=P_Contactor+_IGBT PCB P_Contactor-=P_Contactor-_IGBT PCB PP+=PP+ PP-=PP- SPI_IN_CLK=SPI_IN_CLK_IGBT PCB SPI_IN_DATA=SPI_IN_DATA_IGBT PCB SPI_IN_SYNC=SPI_IN_SYNC_IGBT PCB SPI_OUT_CLK=SPI_OUT_CLK_IGBT PCB SPI_OUT_DATA=SPI_OUT_DATA_IGBT PCB SPI_OUT_SYNC=SPI_OUT_SYNC_IGBT PCB

### Notes on the sheet
- T-Type PCB
- Bottom Inductor Cold Plate
- Top Inductor Cold Plate
- (near C1-1) Capacitor Bank Cold Plate
- .125" x 1.064" Busbar
- Voltages/Currents
- T-Type Cell RMS Voltages:
  between X and Y: 510V
  across inductor winding (X,PP+): 803V
  across inductor winding (Y,PP-): 803V
  across capacitor branch (PP+,PP-): 1720V
  at X: 330V
  at Y: 330V
  at PP+: 890V
  at PP-: 890V
- T-Type Cell RMS Currents:
  through inductor winding: 47A
  through parallel capacitor: 50A
  through P: 32A
  through N: 31A
  through capacitor PN: 17.7A
  through capacitor PO: 13A
  through capacitor ON: 13A
- T-Type Cell Mean Currents:
  through P: 31A
  through N: 31A
- T-Type Cell Max Voltages:
  between X and Y: 692V
  across inductor winding (X,PP+): 1261V
  across inductor winding (Y,PP-): 1261V
  across capacitor branch (PP+,PP-): 2523V
  at X: 397V
  at Y: 397V
  at PP+:1620V
  at PP-: 1620V
- T-Type Cell MAX Currents:
  through inductor winding: 69A
  through parallel capacitor: 73A
  through P: 41A
  through N: 41A
- T-Type Cell Voltages (Peak, RMS):
  between X and Y: 692V, 509V
  across inductor winding (X,PP+): 1262V, 804V
  across inductor winding (Y,PP-): 1262V, 804V
  across capacitor branch (PP+,PP-): 2523V, 1720V
  at X: 397V, 332V
  at Y: 397V, 332V
  at PP+:1623V, 886V
  at PP-: 1623V, 886V
- T-Type Cell Currents (Peak, Mean, RMS):
  through inductor winding: 68A, 0A, 46A
  through parallel capacitor: 73A, 0A, 50A
  through capacitor PN: 415A, 0A, 18A
  through capacitor PO: 819A, 0A, 13A
  through capacitor ON: 820A, 0A, 13A
  through P: 41A, 31A, 32A
  through O: 48A, 0A, 13A
  through N: 41A, 31A, 31A
- 18 AWG
- Thermal Switch PN 1NT01L-7937
- 14 AWG
- Coolant goes to bottom cold plate, then top, then to Capacitor cold plate
- Legend
- Port Color Definitions:
- Optical Fiber Connection
- Shielded Ethernet Connection
- Standard Electrical Connection
- Coolant Tubing
- Project:
- Engineer:
- Document:
- Approved By:
- Date:
- Revision:
- File:
- Sheet
- of

### Library data of the parts
C1-1-C1-3 C2-1-C2-3 C3-1-C3-3 = Cap: Capacitor; Published: 8-Jun-2000; LatestRevisionDate: 17-Jul-2002; LatestRevisionNote: Re-released for DXP Platform.; PackageReference: RAD-0.3; Publisher: Altium Limited; PackageDescription: Radial Cap, Thru-Hole; 2 Leads; 0.3 in Pin Spacing
C6-C14 = Cap: Capacitor; Value: 100pF; Published: 8-Jun-2000; LatestRevisionDate: 17-Jul-2002; LatestRevisionNote: Re-released for DXP Platform.; PackageReference: RAD-0.3; Publisher: Altium Limited; PackageDescription: Radial Cap, Thru-Hole; 2 Leads; 0.3 in Pin Spacing
L1-L3 L?#1-L?#3 = Inductor: Code_IEC: 1005; Value: 10mH; Published: 8-Jun-2000; LatestRevisionDate: 29-May-2009; LatestRevisionNote: IPC-7351 Footprint Added.; PackageReference: 0402-A; Publisher: Altium Limited; PackageDescription: Chip Inductor; Code_JEITA: 0402

## Sheet Primary_Cabinet.SchDoc: <Document>
size Letter; Engineer: <Engineer>; Organization: UPEL; Address1: USU Power Electronics Lab; Address2: USTAR Building 620, RM 118; Address3: 1600 N 620 E; Address4: North Logan, UT 84341; DocumentNumber: 5; Revision: v1; SheetNumber: 5; SheetTotal: 16; ProjectName: <Project>
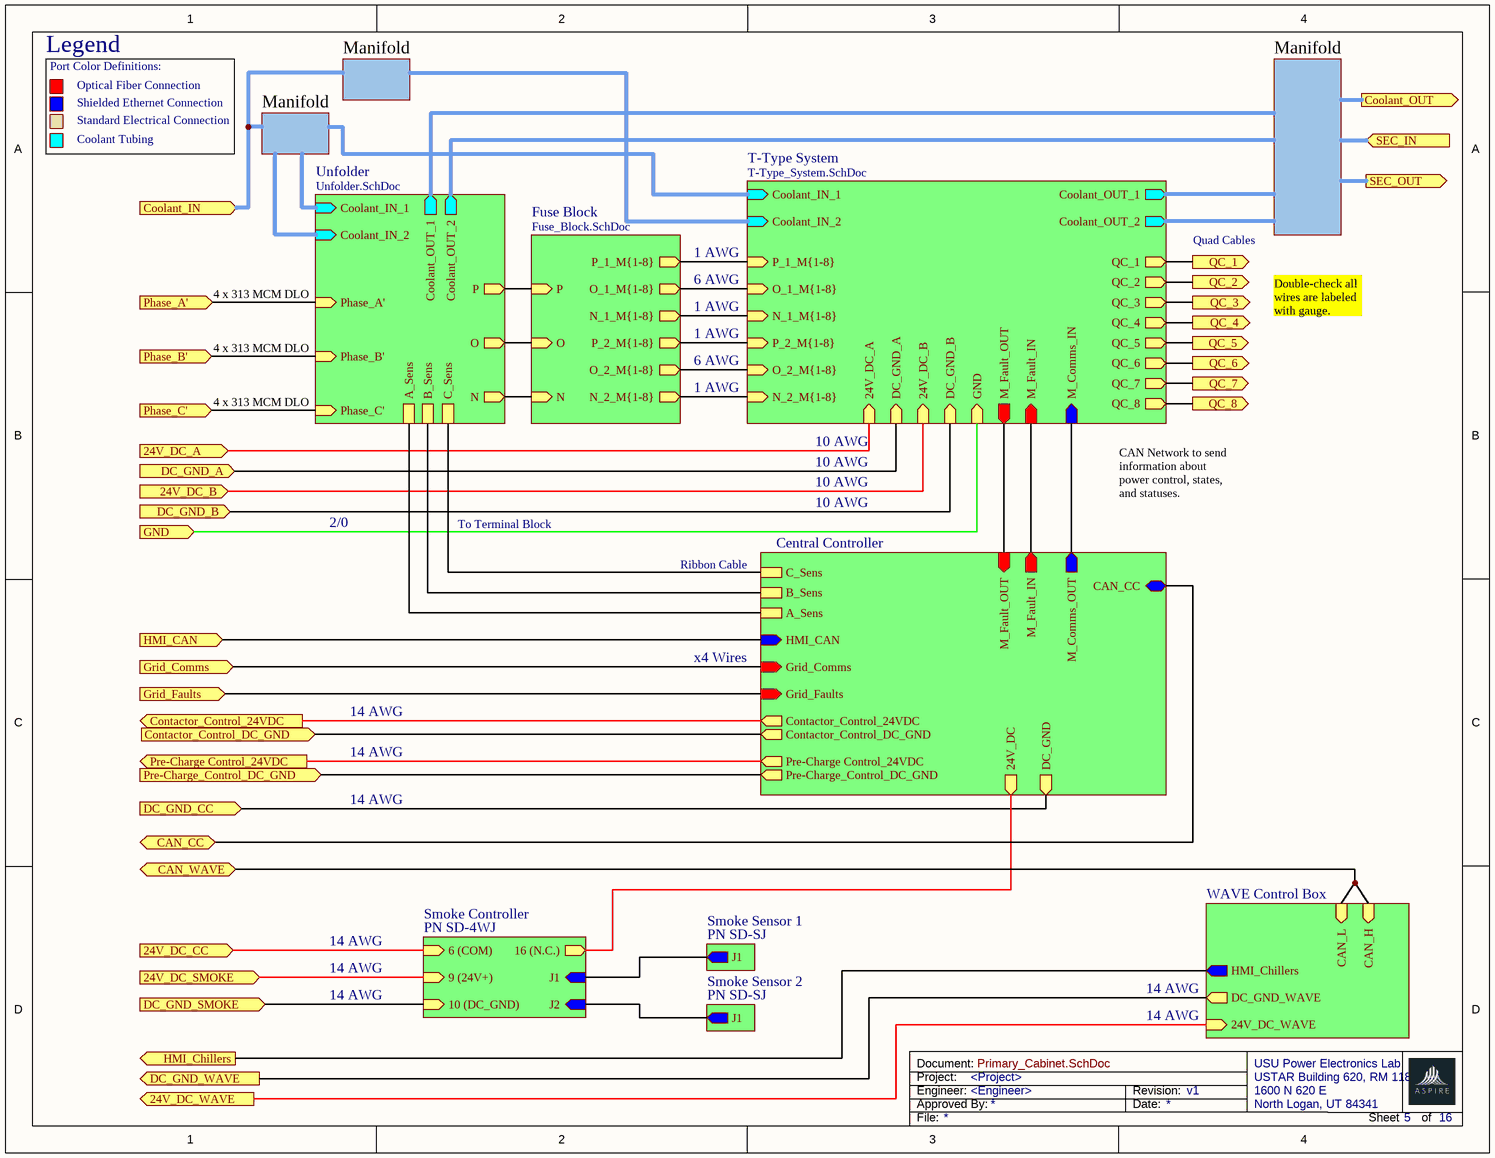
[diagram p2: Primary_Cabinet.SchDoc]

### Sub-sheets
Central Controller = File Name (file not in this document): HMI_CAN (in), Grid_Comms (in), Grid_Faults (in), 24V_DC (out), Contactor_Control_24VDC (out), Contactor_Control_DC_GND (out), M_Fault_OUT (in), M_Fault_IN (out), M_Comms_OUT (out), DC_GND (out), Pre-Charge_Control_DC_GND (out), Pre-Charge Control_24VDC (out), CAN_CC (bidir), C_Sens, B_Sens, A_Sens
Fuse Block = Fuse_Block.SchDoc: P (in), O (in), N (in), N_2_M{1-8} (out), O_2_M{1-8} (out), P_2_M{1-8} (out), N_1_M{1-8} (out), O_1_M{1-8} (out), P_1_M{1-8} (out)
Smoke Controller = PN SD-4WJ (file not in this document): 10 (DC_GND) (in), 9 (24V+) (in), 16 (N.C.) (out), 6 (COM) (in), J1 (in), J2 (in)
Smoke Sensor 1 = PN SD-SJ (file not in this document): J1 (out)
Smoke Sensor 2 = PN SD-SJ (file not in this document): J1 (out)
T-Type System = T-Type_System.SchDoc: Coolant_IN_1 (in), Coolant_OUT_1 (out), QC_2 (out), QC_1 (out), QC_3 (out), QC_6 (out), QC_7 (out), QC_8 (out), QC_5 (out), QC_4 (out), N_2_M{1-8} (in), O_2_M{1-8} (in), P_2_M{1-8} (in), N_1_M{1-8} (in), O_1_M{1-8} (in), P_1_M{1-8} (in), M_Fault_OUT (out), M_Comms_IN (in), M_Fault_IN (in), 24V_DC_B (in), 24V_DC_A (in), DC_GND_A (in), DC_GND_B (in), Coolant_IN_2 (in), Coolant_OUT_2 (out), GND (in)
Unfolder = Unfolder.SchDoc: Phase_B' (in), Phase_A' (in), N (out), P (out), O (out), Phase_C' (in), Coolant_IN_2 (in), Coolant_OUT_2 (out), Coolant_IN_1 (in), Coolant_OUT_1 (out), C_Sens, B_Sens, A_Sens
WAVE Control Box = box.SchDoc (file not in this document): 24V_DC_WAVE (in), DC_GND_WAVE (out), HMI_Chillers (out), CAN_L (in), CAN_H (in)

### Ports
24V_DC_A (in), 24V_DC_B (in), 24V_DC_CC (in), 24V_DC_SMOKE (in), 24V_DC_WAVE (out), CAN_CC (bidir), CAN_WAVE (bidir), Contactor_Control_24VDC (out), Contactor_Control_DC_GND (in), Coolant_IN (in), Coolant_OUT (out), DC_GND_A (in), DC_GND_B (in), DC_GND_CC (in), DC_GND_SMOKE (in), DC_GND_WAVE (out), GND (in), Grid_Comms (in), Grid_Faults (in), HMI_CAN (in), HMI_Chillers (out), Phase_A' (in), Phase_B' (in), Phase_C' (in), Pre-Charge Control_24VDC (out), Pre-Charge_Control_DC_GND (in), QC_1 (out), QC_2 (out), QC_3 (out), QC_4 (out), QC_5 (out), QC_6 (out), QC_7 (out), QC_8 (out), SEC_IN (in), SEC_OUT (out)

### Nets
24V_DC_A: port 24V_DC_A, sheet T-Type System/24V_DC_A
24V_DC_B: port 24V_DC_B, sheet T-Type System/24V_DC_B
24V_DC_CC: port 24V_DC_CC, sheet Smoke Controller/6 (COM)
24V_DC_SMOKE: port 24V_DC_SMOKE, sheet Smoke Controller/9 (24V+)
24V_DC_WAVE: port 24V_DC_WAVE, sheet WAVE Control Box/24V_DC_WAVE
CAN_CC: port CAN_CC, sheet Central Controller/CAN_CC
CAN_WAVE: port CAN_WAVE, sheet WAVE Control Box/CAN_L, sheet WAVE Control Box/CAN_H
Contactor_Control_24VDC: port Contactor_Control_24VDC, sheet Central Controller/Contactor_Control_24VDC
Contactor_Control_DC_GND: port Contactor_Control_DC_GND, sheet Central Controller/Contactor_Control_DC_GND
DC_GND_A: port DC_GND_A, sheet T-Type System/DC_GND_A
DC_GND_B: port DC_GND_B, sheet T-Type System/DC_GND_B
DC_GND_CC: port DC_GND_CC, sheet Central Controller/DC_GND
DC_GND_SMOKE: port DC_GND_SMOKE, sheet Smoke Controller/10 (DC_GND)
DC_GND_WAVE: port DC_GND_WAVE, sheet WAVE Control Box/DC_GND_WAVE
GND: port GND, sheet T-Type System/GND
Grid_Comms: port Grid_Comms, sheet Central Controller/Grid_Comms
Grid_Faults: port Grid_Faults, sheet Central Controller/Grid_Faults
HMI_CAN: port HMI_CAN, sheet Central Controller/HMI_CAN
HMI_Chillers: port HMI_Chillers, sheet WAVE Control Box/HMI_Chillers
N: sheet Fuse Block/N, sheet Unfolder/N
N_1_M{1-8}: sheet Fuse Block/N_1_M{1-8}, sheet T-Type System/N_1_M{1-8}
N_2_M{1-8}: sheet Fuse Block/N_2_M{1-8}, sheet T-Type System/N_2_M{1-8}
O: sheet Fuse Block/O, sheet Unfolder/O
O_1_M{1-8}: sheet Fuse Block/O_1_M{1-8}, sheet T-Type System/O_1_M{1-8}
O_2_M{1-8}: sheet Fuse Block/O_2_M{1-8}, sheet T-Type System/O_2_M{1-8}
P: sheet Fuse Block/P, sheet Unfolder/P
P_1_M{1-8}: sheet Fuse Block/P_1_M{1-8}, sheet T-Type System/P_1_M{1-8}
P_2_M{1-8}: sheet Fuse Block/P_2_M{1-8}, sheet T-Type System/P_2_M{1-8}
Phase_A': port Phase_A', sheet Unfolder/Phase_A'
Phase_B': port Phase_B', sheet Unfolder/Phase_B'
Phase_C': port Phase_C', sheet Unfolder/Phase_C'
Pre-Charge Control_24VDC: port Pre-Charge Control_24VDC, sheet Central Controller/Pre-Charge Control_24VDC
Pre-Charge_Control_DC_GND: port Pre-Charge_Control_DC_GND, sheet Central Controller/Pre-Charge_Control_DC_GND
QC_1: port QC_1, sheet T-Type System/QC_1
QC_2: port QC_2, sheet T-Type System/QC_2
QC_3: port QC_3, sheet T-Type System/QC_3
QC_4: port QC_4, sheet T-Type System/QC_4
QC_5: port QC_5, sheet T-Type System/QC_5
QC_6: port QC_6, sheet T-Type System/QC_6
QC_7: port QC_7, sheet T-Type System/QC_7
QC_8: port QC_8, sheet T-Type System/QC_8
(unnamed): sheet Central Controller/24V_DC, sheet Smoke Controller/16 (N.C.)
(unnamed): sheet Central Controller/M_Fault_OUT, sheet T-Type System/M_Fault_OUT
(unnamed): sheet Central Controller/M_Fault_IN, sheet T-Type System/M_Fault_IN
(unnamed): sheet Central Controller/M_Comms_OUT, sheet T-Type System/M_Comms_IN
(unnamed): sheet Central Controller/C_Sens, sheet Unfolder/C_Sens
(unnamed): sheet Central Controller/B_Sens, sheet Unfolder/B_Sens
(unnamed): sheet Central Controller/A_Sens, sheet Unfolder/A_Sens
(unnamed): sheet Smoke Controller/J1, sheet Smoke Sensor 1/J1
(unnamed): sheet Smoke Controller/J2, sheet Smoke Sensor 2/J1

### Notes on the sheet
- Legend
- Port Color Definitions:
- Optical Fiber Connection
- Manifold
- Shielded Ethernet Connection
- Standard Electrical Connection
- Coolant Tubing
- 4 x 313 MCM DLO
- 1 AWG
- 6 AWG
- Quad Cables
- Double-check all wires are labeled with gauge.
- 10 AWG
- CAN Network to send information about power control, states, and statuses.
- 2/0
- To Terminal Block
- Ribbon Cable
- x4 Wires
- 14 AWG
- Project:
- Engineer:
- Document:
- Approved By:
- Date:
- Revision:
- File:
- Sheet
- of

## Sheet Fuse_Block.SchDoc: <Document>
size Letter; Engineer: <Engineer>; Organization: UPEL; Address1: USU Power Electronics Lab; Address2: USTAR Building 620, RM 118; Address3: 1600 N 620 E; Address4: North Logan, UT 84341; DocumentNumber: 6; Revision: v1; SheetNumber: 6; SheetTotal: 16; ProjectName: <Project>
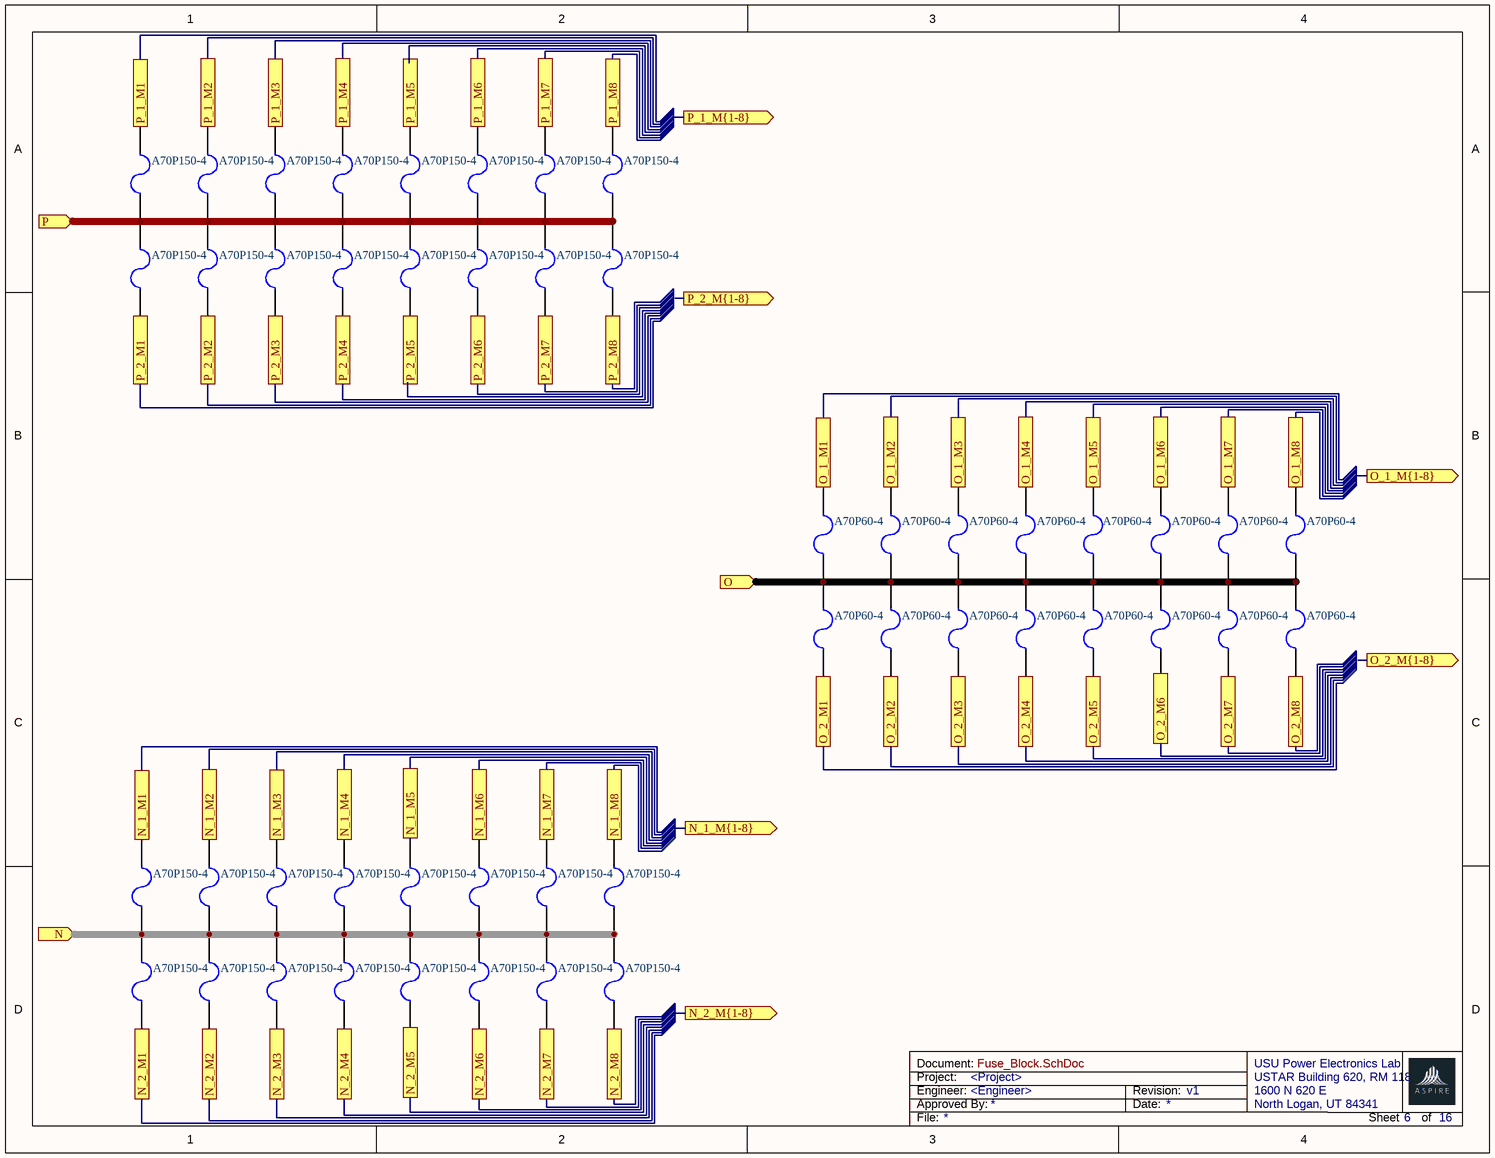
[diagram p3: Fuse_Block.SchDoc]

### Parts
F6  A70P150-4  [1206]
F17  A70P150-4  [1206]
F18  A70P150-4  [1206]
F19  A70P150-4  [1206]
F20  A70P150-4  [1206]
F21  A70P150-4  [1206]
F22  A70P150-4  [1206]
F23  A70P150-4  [1206]
F24  A70P150-4  [1206]
F25  A70P150-4  [1206]
F26  A70P150-4  [1206]
F27  A70P150-4  [1206]
F28  A70P150-4  [1206]
F29  A70P150-4  [1206]
F30  A70P150-4  [1206]
F31  A70P150-4  [1206]
F32  A70P60-4  [1206]
F33  A70P60-4  [1206]
F34  A70P60-4  [1206]
F35  A70P60-4  [1206]
F36  A70P60-4  [1206]
F37  A70P60-4  [1206]
F38  A70P60-4  [1206]
F39  A70P60-4  [1206]
F40  A70P60-4  [1206]
F41  A70P60-4  [1206]
F42  A70P60-4  [1206]
F43  A70P60-4  [1206]
F44  A70P60-4  [1206]
F45  A70P60-4  [1206]
F46  A70P60-4  [1206]
F47  A70P60-4  [1206]
F48  A70P150-4  [1206]
F49  A70P150-4  [1206]
F50  A70P150-4  [1206]
F51  A70P150-4  [1206]
F52  A70P150-4  [1206]
F53  A70P150-4  [1206]
F54  A70P150-4  [1206]
F55  A70P150-4  [1206]
F56  A70P150-4  [1206]
F57  A70P150-4  [1206]
F58  A70P150-4  [1206]
F59  A70P150-4  [1206]
F60  A70P150-4  [1206]
F61  A70P150-4  [1206]
F62  A70P150-4  [1206]
F63  A70P150-4  [1206]

### Ports
N (in), N_1_M1, N_1_M2, N_1_M3, N_1_M4, N_1_M5, N_1_M6, N_1_M7, N_1_M8, N_1_M{1-8} (out), N_2_M1, N_2_M2, N_2_M3, N_2_M4, N_2_M5, N_2_M6, N_2_M7, N_2_M8, N_2_M{1-8} (out), O (in), O_1_M1, O_1_M2, O_1_M3, O_1_M4, O_1_M5, O_1_M6, O_1_M7, O_1_M8, O_1_M{1-8} (out), O_2_M1, O_2_M2, O_2_M3, O_2_M4, O_2_M5, O_2_M6, O_2_M7, O_2_M8, O_2_M{1-8} (out), P (in), P_1_M1, P_1_M2, P_1_M3, P_1_M4, P_1_M5, P_1_M6, P_1_M7, P_1_M8, P_1_M{1-8} (out), P_2_M1, P_2_M2, P_2_M3, P_2_M4, P_2_M5, P_2_M6, P_2_M7, P_2_M8, P_2_M{1-8} (out)

### Nets
N: F48.1 F49.1 F50.1 F51.1 F52.1 F53.1 F54.1 F55.1 F56.2 F57.2 F58.2 F59.2 F60.2 F61.2 F62.2 F63.2 ; port N
N_1_M1: F48.2 ; port N_1_M1
N_1_M2: F49.2 ; port N_1_M2
N_1_M3: F50.2 ; port N_1_M3
N_1_M4: F51.2 ; port N_1_M4
N_1_M5: F52.2 ; port N_1_M5
N_1_M6: F53.2 ; port N_1_M6
N_1_M7: F54.2 ; port N_1_M7
N_1_M8: F55.2 ; port N_1_M8
N_2_M1: F56.1 ; port N_2_M1
N_2_M2: F57.1 ; port N_2_M2
N_2_M3: F58.1 ; port N_2_M3
N_2_M4: F59.1 ; port N_2_M4
N_2_M6: F61.1 ; port N_2_M6
N_2_M7: F62.1 ; port N_2_M7
N_2_M8: F63.1 ; port N_2_M8
O: F32.1 F33.1 F34.1 F35.1 F36.1 F37.1 F38.1 F39.1 F40.2 F41.2 F42.2 F43.2 F44.2 F45.2 F46.2 F47.2 ; port O
O_1_M1: F32.2 ; port O_1_M1
O_1_M2: F33.2 ; port O_1_M2
O_1_M3: F34.2 ; port O_1_M3
O_1_M4: F35.2 ; port O_1_M4
O_1_M5: F36.2 ; port O_1_M5
O_1_M6: F37.2 ; port O_1_M6
O_1_M7: F38.2 ; port O_1_M7
O_1_M8: F39.2 ; port O_1_M8
O_2_M1: F40.1 ; port O_2_M1
O_2_M2: F41.1 ; port O_2_M2
O_2_M3: F42.1 ; port O_2_M3
O_2_M4: F43.1 ; port O_2_M4
O_2_M5: F44.1 ; port O_2_M5
O_2_M7: F46.1 ; port O_2_M7
O_2_M8: F47.1 ; port O_2_M8
P: F6.1 F17.1 F18.1 F19.1 F20.1 F21.1 F22.1 F23.1 F24.2 F25.2 F26.2 F27.2 F28.2 F29.2 F30.2 F31.2 ; port P
P_1_M1: F6.2 ; port P_1_M1
P_1_M2: F17.2 ; port P_1_M2
P_1_M3: F18.2 ; port P_1_M3
P_1_M4: F19.2 ; port P_1_M4
P_1_M5: F20.2 ; port P_1_M5
P_1_M6: F21.2 ; port P_1_M6
P_1_M7: F22.2 ; port P_1_M7
P_1_M8: F23.2 ; port P_1_M8
P_2_M1: F24.1 ; port P_2_M1
P_2_M2: F25.1 ; port P_2_M2
P_2_M3: F26.1 ; port P_2_M3
P_2_M4: F27.1 ; port P_2_M4
P_2_M5: F28.1 ; port P_2_M5
P_2_M6: F29.1 ; port P_2_M6
P_2_M7: F30.1 ; port P_2_M7
P_2_M8: F31.1 ; port P_2_M8

Not connected (* = marked no-connect by the designer): F45 1; F60 1

### Notes on the sheet
- Project:
- Engineer:
- Document:
- Approved By:
- Date:
- Revision:
- File:
- Sheet
- of

### Library data of the parts
F6 F17-F63 = CMP-005-000011-1: 2 A 63 V AC 63 V DC Fuse Board Mount (Cartridge Style Excluded) Surface Mount 1206 (3216 Metric); Design Item ID: 0685T2000-01; Source: F.SchLib; Pin Count: 2; MFR Part #: 0685T2000-01; Component Type: Standard

## Sheet Unfolder.SchDoc: <Document>
size Letter; Engineer: <Engineer>; Organization: UPEL; Address1: USU Power Electronics Lab; Address2: USTAR Building 620, RM 118; Address3: 1600 N 620 E; Address4: North Logan, UT 84341; DocumentNumber: 7; Revision: v1; SheetNumber: 7; SheetTotal: 16; ProjectName: <Project>
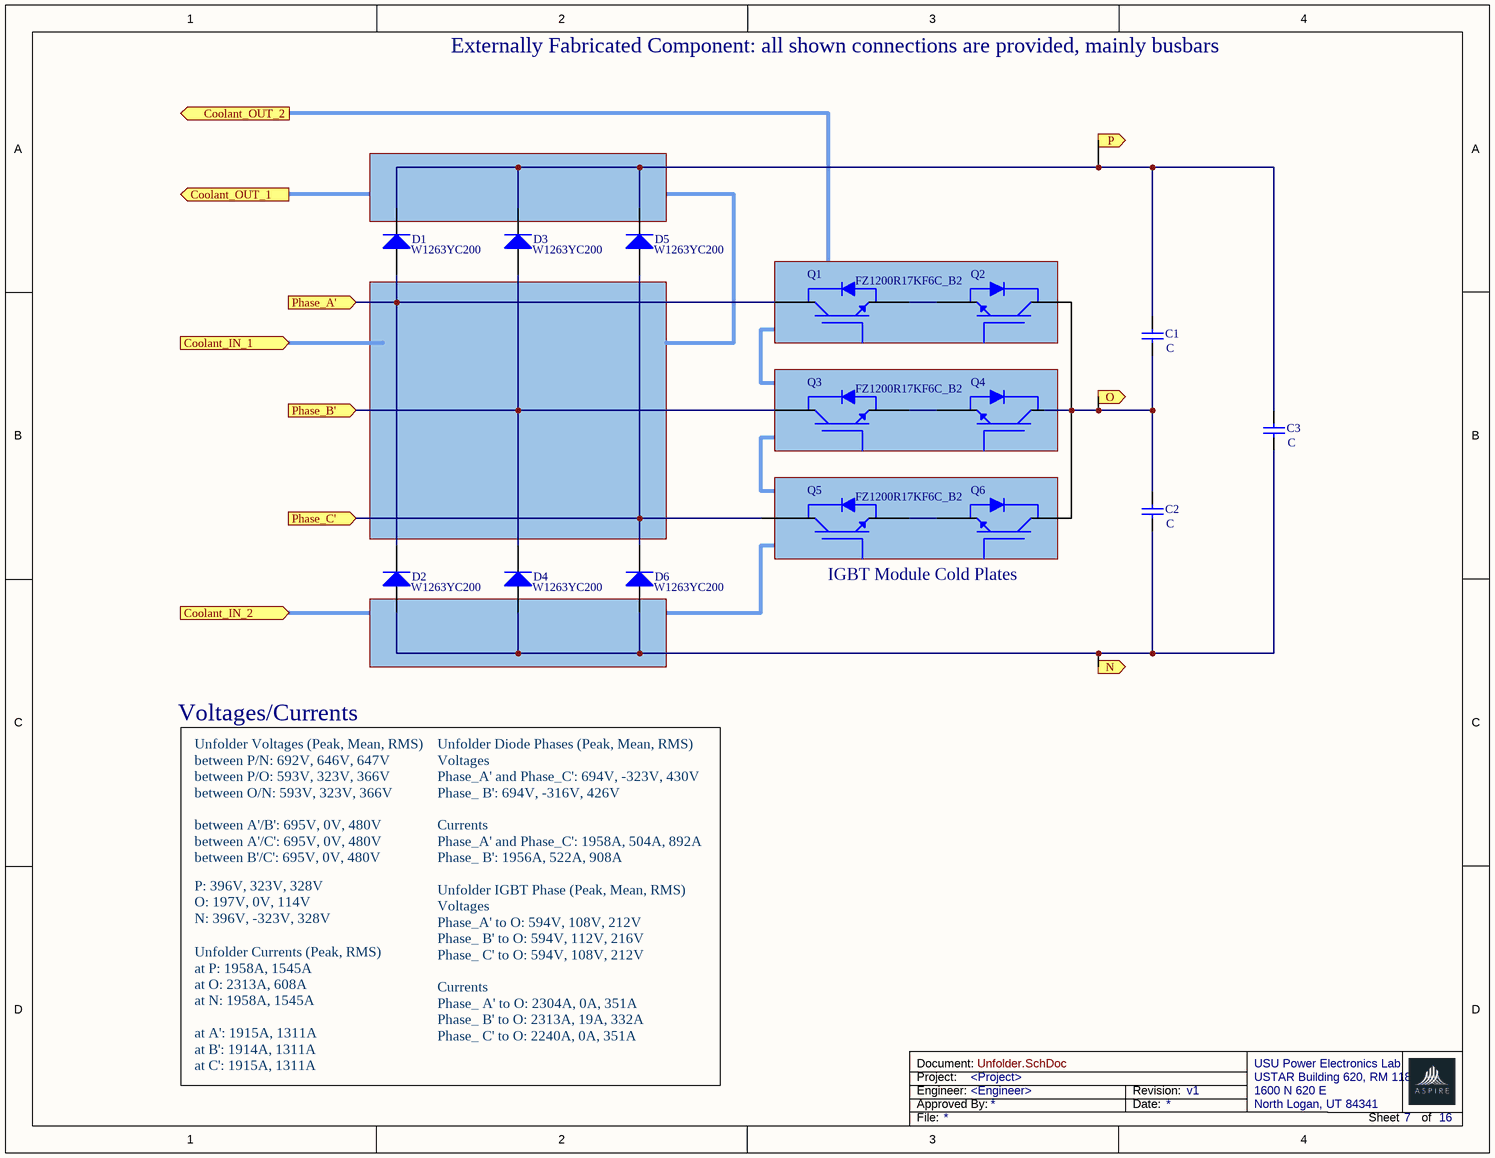
[diagram p4: Unfolder.SchDoc]

### Parts
(Parts that share a designator on the sheet are numbered #1, #2 ... from top to bottom, then left to right.)
C1  value C  [RAD-0.3]  (hidden comment: Cap)
C2  value C  [RAD-0.3]  (hidden comment: Cap)
C3  value C  [RAD-0.3]  (hidden comment: Cap)
D1#1  Diode  [SMC]  (value not drawn)
D2#1  Diode  [SMC]  (value not drawn)
D3#1  Diode  [SMC]  (value not drawn)
D4#1  Diode  [SMC]  (value not drawn)
D5#1  Diode  [SMC]  (value not drawn)
D6#1  Diode  [SMC]  (value not drawn)
Q1  IGBT_Module_1  (value not drawn)
Q2  IGBT_Module_2  (value not drawn)
Q3  IGBT_Module_1  (value not drawn)
Q4  IGBT_Module_2  (value not drawn)
Q5  IGBT_Module_1  (value not drawn)
Q6  IGBT_Module_2  (value not drawn)

### Ports
Coolant_IN_1 (in), Coolant_IN_2 (in), Coolant_OUT_1 (out), Coolant_OUT_2 (out), N (out), O (out), P (out), Phase_A' (in), Phase_B' (in), Phase_C' (in)

### Nets
N: C2.2 C3.2 D2#1.1(A) D4#1.1(A) D6#1.1(A) ; port N
O: C1.2 C2.1 ; port O
P: C1.1 C3.1 D1#1.2(K) D3#1.2(K) D5#1.2(K) ; port P
Phase_A': D1#1.1(A) D2#1.2(K) ; port Phase_A'
Phase_B': D3#1.1(A) D4#1.2(K) ; port Phase_B'
Phase_C': D5#1.1(A) D6#1.2(K) ; port Phase_C'

Not connected (* = marked no-connect by the designer): Q1 1(0) 2(1); Q2 1(2) 2(3); Q3 1(0) 2(1); Q4 1(2) 2(3); Q5 1(0) 2(1); Q6 1(2) 2(3)

### Notes on the sheet
- Externally Fabricated Component: all shown connections are provided, mainly busbars
- (near D1#1) W1263YC200
- (near D3#1) W1263YC200
- (near D5#1) W1263YC200
- (near Q1) Q1
- FZ1200R17KF6C_B2
- (near Q3) Q3
- (near Q5) Q5
- (near D2#1) W1263YC200
- (near D4#1) W1263YC200
- (near D6#1) W1263YC200
- IGBT Module Cold Plates
- Voltages/Currents
- Unfolder Voltages (Peak, Mean, RMS)
  between P/N: 692V, 646V, 647V
  between P/O: 593V, 323V, 366V
  between O/N: 593V, 323V, 366V
  between A'/B': 695V, 0V, 480V
  between A'/C': 695V, 0V, 480V
  between B'/C': 695V, 0V, 480V
- P: 396V, 323V, 328V                       O: 197V, 0V, 114V                         N: 396V, -323V, 328V
- Unfolder Diode Phases (Peak, Mean, RMS)
  Voltages
  Phase_A' and Phase_C': 694V, -323V, 430V
  Phase_ B': 694V, -316V, 426V
  Currents
  Phase_A' and Phase_C': 1958A, 504A, 892A
  Phase_ B': 1956A, 522A, 908A
  Unfolder IGBT Phase (Peak, Mean, RMS)
  Voltages
  Phase_A' to O: 594V, 108V, 212V
  Phase_ B' to O: 594V, 112V, 216V
  Phase_ C' to O: 594V, 108V, 212V
  Currents
  Phase_ A' to O: 2304A, 0A, 351A
  Phase_ B' to O: 2313A, 19A, 332A
  Phase_ C' to O: 2240A, 0A, 351A
- Unfolder Currents (Peak, RMS)
  at P: 1958A, 1545A
  at O: 2313A, 608A
  at N: 1958A, 1545A
  at A': 1915A, 1311A
  at B': 1914A, 1311A
  at C': 1915A, 1311A
- Project:
- Engineer:
- Document:
- Approved By:
- Date:
- Revision:
- File:
- Sheet
- of

### Library data of the parts
C1-C3 = Cap: Capacitor; Published: 8-Jun-2000; LatestRevisionDate: 17-Jul-2002; LatestRevisionNote: Re-released for DXP Platform.; PackageReference: RAD-0.3; Publisher: Altium Limited; PackageDescription: Radial Cap, Thru-Hole; 2 Leads; 0.3 in Pin Spacing
D1#1 D2#1 D3#1 D4#1 D5#1 D6#1 = Diode: Default Diode; Published: 8-Jun-2000; LatestRevisionDate: 17-Jul-2002; LatestRevisionNote: Re-released for DXP Platform.; PackageVersion: Sep-1996; PackageReference: SMC; Publisher: Altium Limited; PackageDescription: DO-214-AB/SMC; 2 C-Bend Leads; Body 7.9 x 5.9 mm, inc. leads (LxW); Code_JEDEC: DO-214-AB